# Altium schematic sheet HYDRA_REGULATORS.SchDoc
size B; SheetNumber: 5; SheetTotal: 11
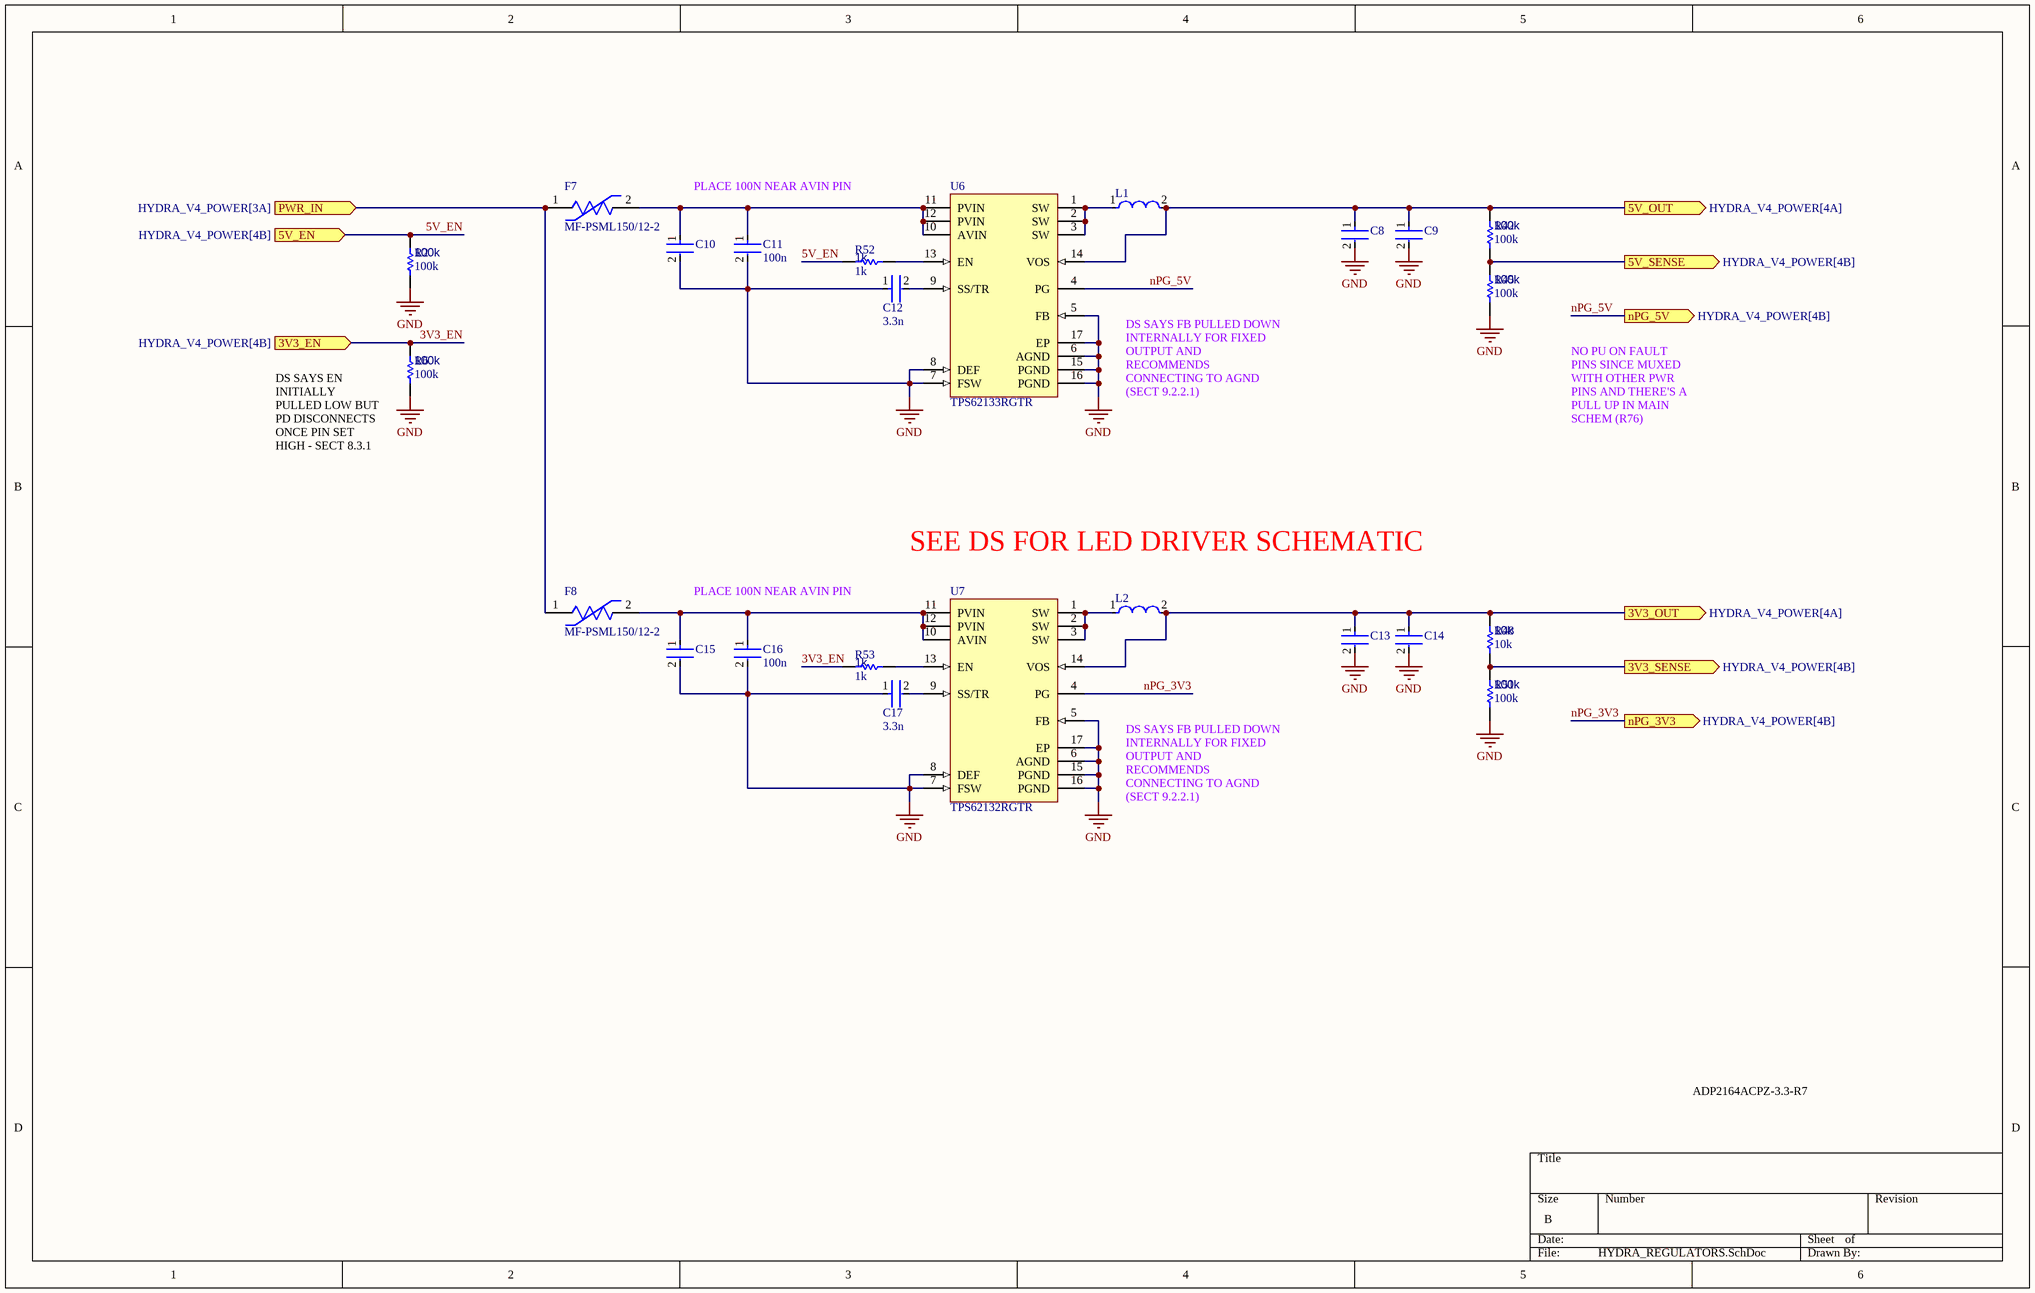
[diagram p0: HYDRA_REGULATORS.SchDoc]

## Parts
C8  GRM21BR61E226ME44L  [FP-GRM21B-0_2-e0_2_0_7-IPC_B]  (value not drawn)
C9  TMK212BBJ106KG-T  [FP-0805-L_2_0_0_2-W_1_25-MFG]  (value not drawn)
C10  TMK212BBJ106KG-T  [FP-0805-L_2_0_0_2-W_1_25-MFG]  (value not drawn)
C11  100n  [FP-0402-L_1_0_0_05-W_0_5-IPC_A]
C12  3.3n  [FP-0402-L_1_0_0_05-W_0_5-IPC_A]
C13  GRM21BR61E226ME44L  [FP-GRM21B-0_2-e0_2_0_7-IPC_B]  (value not drawn)
C14  TMK212BBJ106KG-T  [FP-0805-L_2_0_0_2-W_1_25-MFG]  (value not drawn)
C15  TMK212BBJ106KG-T  [FP-0805-L_2_0_0_2-W_1_25-MFG]  (value not drawn)
C16  100n  [FP-0402-L_1_0_0_05-W_0_5-IPC_A]
C17  3.3n  [FP-0402-L_1_0_0_05-W_0_5-IPC_A]
F7  MF-PSML150/12-2  [FP-MF-PSMF-MFG]
F8  MF-PSML150/12-2  [FP-MF-PSMF-MFG]
L1  IHLP1212BZER2R2M11  [FP-IHLP-1212BZ-11-MFG]  (value not drawn)
L2  IHLP1212BZER2R2M11  [FP-IHLP-1212BZ-11-MFG]  (value not drawn)
R2  100k  [R0603B]
R6  100k  [R0603B]
R42  100k  [R0603B]
R45  100k  [R0603B]
R48  10k  [R0603B]
R51  100k  [R0603B]
R52  1k  [R0603B]
R53  1k  [R0603B]
U6  TPS62133RGTR  [RGT0016C_V]
U7  TPS62132RGTR  [RGT0016C_V]

## Ports
3V3_EN (in, see HYDRA_V4_POWER[4B]), 3V3_OUT (out, see HYDRA_V4_POWER[4A]), 3V3_SENSE (out, see HYDRA_V4_POWER[4B]), 5V_EN (in, see HYDRA_V4_POWER[4B]), 5V_OUT (out, see HYDRA_V4_POWER[4A]), 5V_SENSE (out, see HYDRA_V4_POWER[4B]), nPG_3V3 (out, see HYDRA_V4_POWER[4B]), nPG_5V (out, see HYDRA_V4_POWER[4B]), PWR_IN (in, see HYDRA_V4_POWER[3A])

## Nets
GND: C8.2 C9.2 C10.2 C11.2 C12.1 C13.2 C14.2 C15.2 C16.2 C17.1 R2.2 R6.2 R45.1 R51.1 U6.5(FB) U6.6(AGND) U6.7(FSW) U6.8(DEF) U6.15(PGND) U6.16(PGND) U6.17(EP) U7.5(FB) U7.6(AGND) U7.7(FSW) U7.8(DEF) U7.15(PGND) U7.16(PGND) U7.17(EP)
3V3_EN: R6.1 R53.2 ; port 3V3_EN
3V3_OUT: C13.1 C14.1 L2.2 R48.2 U7.14(VOS) ; port 3V3_OUT
3V3_SENSE: R48.1 R51.2 ; port 3V3_SENSE
5V_EN: R2.1 R52.2 ; port 5V_EN
5V_OUT: C8.1 C9.1 L1.2 R42.2 U6.14(VOS) ; port 5V_OUT
5V_SENSE: R42.1 R45.2 ; port 5V_SENSE
nPG_3V3: U7.4(PG) ; port nPG_3V3
nPG_5V: U6.4(PG) ; port nPG_5V
PWR_IN: F7.1 F8.1 ; port PWR_IN
NetC10_1: C10.1 C11.1 F7.2 U6.10(AVIN) U6.11(PVIN) U6.12(PVIN)
NetC12_2: C12.2 U6.9(SS/TR)
NetC15_1: C15.1 C16.1 F8.2 U7.10(AVIN) U7.11(PVIN) U7.12(PVIN)
NetC17_2: C17.2 U7.9(SS/TR)
NetL1_1: L1.1 U6.1(SW) U6.2(SW) U6.3(SW)
NetL2_1: L2.1 U7.1(SW) U7.2(SW) U7.3(SW)
NetR52_1: R52.1 U6.13(EN)
NetR53_1: R53.1 U7.13(EN)

## Notes on the sheet
- PLACE 100N NEAR AVIN PIN
- DS SAYS FB PULLED DOWN INTERNALLY FOR FIXED OUTPUT AND RECOMMENDS CONNECTING TO AGND (SECT 9.2.2.1)
- NO PU ON FAULT PINS SINCE MUXED WITH OTHER PWR PINS AND THERE'S A PULL UP IN MAIN SCHEM (R76)
- (near R6) DS SAYS EN INITIALLY PULLED LOW BUT PD DISCONNECTS ONCE PIN SET HIGH - SECT 8.3.1
- SEE DS FOR LED DRIVER SCHEMATIC
- ADP2164ACPZ-3.3-R7

## Library data of the parts
C8 C13 = CMP-2007-03222-3: Chip Multilayer Ceramic Capacitors for General Purpose, 0805, 22uF, X5R, 15%, 20%, 25V; Case/Package: 0805; Depth: 1.25mm; Resistor Type: Ceramic; Voltage Rating: 25V; Lead Free: Lead Free; Voltage Rating (DC): 25V; Case Code (Metric): 2012; Thickness: 0.057inch; REACH SVHC: No SVHC; Material: Ceramic; Tolerance: 20%; Length: 2mm; Capacitance: 22uF; Case Code (Imperial): 0805; Max Operating Temperature: 85°C; Termination: SMD/SMT; Weight: 0.000335oz; Dielectric: X5R; Packaging: Tape and Reel; Voltage: 25V; Package Quantity: 3000; Height: 1.25mm; Mount: Surface Mount; Width: 1.25mm; Min Operating Temperature: -55°C; Value: GRM21BR61E226ME44L
C9 C10 C14 C15 = CMP-14477-000079-3: Multilayer Ceramic Capacitor 10uF 25V X5R 10% SMD 0805 T/R; Voltage: 16V; Dielectric: X7R; Number of Pins: 2; Width: 0.049inch; REACH SVHC: No SVHC; Packaging: Tape and Reel; Max Operating Temperature: 85°C; Length: 0.079inch; Termination: SMD/SMT; RoHS Compliant: Yes; Thickness: 0.053inch; Case/Package: 0805; Case Code (Imperial): 0805; Capacitance: 10uF; Lead Free: Lead Free; Voltage Rating: 25V; Resistor Type: Ceramic; Voltage Rating (DC): 25V; Case Code (Metric): 2012; Mount: Surface Mount; Package Quantity: 1; Height: 1.25mm; Series: M; Tolerance: 10%; Min Operating Temperature: -55°C; Value: TMK212BBJ106KG-T
C11 C12 C16 C17 = CMP-001-00058-1: LARGE PADS, 0402 CAP, CHANGE COMMENT TO MATCH REAL P/N; Capacitor Type: Ceramic; Min Operating Temperature: -55°C; Mounting Technology: Surface Mount; Pins: 2; Case/Package: 0402; RoHS Compliant: Yes; Max Operating Temperature: 85°C
  C11 C16: Value: 100n
  C12 C17: Value: 3.3n
F7 F8 = CMP-07400-000013-1: Manufacturer Part Number: MF-PSMF050X-2; Manufacturer: Bourns Inc.; Trip Current: 1A; Trip Time: 0.1s; Value: 0.15-0.9Ω; Hold Current: 0.5A; Current Rating: 40A; Voltage Rating: 6V; Category: Fuse; Temperature: -40°C to +85°C; ComponentLink2Description: Datasheet; Temperature Range High: +85°C; Package: MF-PSMF; Device Class L1: Circuit Protection; Lead Free: Yes; ComponentLink2URL: https://www.bourns.com/docs/product-datasheets/mfpsmf.pdf?sfvrsn=9c05cafe_24; Ambient Temperature Range Low: -40°C; Mouser Description: Resettable Fuses - PPTC .50A 6V 0.15ohm Hold .5 Trip 1; Resistance: 0.15-0.9Ω; Automotive: Yes; Ambient Temperature Range High: +85°C; Device Class L2: PTC Resettable Fuses; Temperature Range Low: -40°C; Device Class L3: unset; Octopart: https://octopart.com/mf-psmf050x-2-bourns-7483438; Digikey Description: PTC RESET FUSE 6V 500MA 0805; Height: 0.85mm; RoHS: TRUE
L1 L2 = CMP-02424-000689-1: FIXED IND 2.2UH 3A 46 MOHM SMD; DC Resistance (DCR): 46mR; Inductance Tolerance: 20%; Saturation Current: 3.3A; Self Resonant Frequency: 55MHz; Core Material: Metal; Shielding: Shielded; Test Frequency: 100kHz; RMS Current (Irms): 3A; Max DC Current: 3A; Contact Plating: Tin; Mount: Surface Mount; Series: IHLP-1212BZ-11; Inductance: 2.2uH; Current Rating: 3A; Height - Seated (Max): 0.079inch; Radiation Hardening: No; Package Quantity: 3000; Max Operating Temperature: 125°C; Military Standard: Not; Depth: 3.2mm; Rated Current-Max: 3A; Height: 2mm; Lead Free: Lead Free; Termination: SMD/SMT; RoHS Compliant: Yes; Tolerance: 20%; Packaging: Tape and Reel; Case/Package: 1212; Number of Pins: 2; Min Operating Temperature: -55°C; Width: 3mm; Length: 3.6mm
R2 R6 R42 R45 R48 R51-R53 = CMP-009-00002-14: Resistor
  R2 R6 R42 R45 R51: Value: 100k
  R48: Value: 10k
  R52 R53: Value: 1k
U6 = CMP-0323-00146-3: Buck Step Down Regulator with 3 to 17 V Input and 5 V Output, -40 to 85 degC, 16-Pin QFN (RGT), Green (RoHS & no Sb/Br); Manufacturer: Texas Instruments; Preset Vout(V): 5; Regulated Outputs(#): 1; Synchronous Rectification: TRUE; Duty Cycle(Max)(%): 100; Vin(Min)(V): 3; Vin(Max)(V): 17; Rating: Catalog; SubFamily: Step-Down Regulator; Switch Current Limit(Typ)(A): 4.2; Iq(Typ)(mA): 0.017; ComponentLink1Description: Datasheet; PackageVersion: revH, Oct-2011; ComponentLink2URL: http://www.ti.com/litv/pdf/mpqf119g; Code_JEDEC: MO-220; ComponentLink2Description: Package Specification; Vout(Max)(V): 5; ComponentLink3URL: Samples URL:http://www.ti.com/product/tps62133#samples; PackageReference: RGT0016C; ComponentLink3Description: URL Link1; Mounting Technology: Surface Mount; DatasheetVersion: SLVSAG7; PartNumber: TPS62133RGTR; Iout(Max)(A): 3; Eco-Plan: Green (RoHS & no Sb/Br); PackageDescription: 16-Pin Plastic Quad Flat No-Lead, 3 x 3 mm Body, 0.5 mm Pitch, 1.7 x 1.7 mm Exposed Pad; Topology: Buck; Vout(Min)(V): 5; ComponentLink1URL: http://www.ti.com/general/docs/lit/getliterature.tsp?genericPartNumber=TPS62133&fileType=pdf
U7 = CMP-0323-00152-3: Buck Step Down Regulator with 3 to 17 V Input and 3.3 V Output, -40 to 85 degC, 16-Pin QFN (RGT), Green (RoHS & no Sb/Br); Manufacturer: Texas Instruments; Switch Current Limit(Typ)(A): 4.2; Vout(Max)(V): 3.3; Iout(Max)(A): 3; Regulated Outputs(#): 1; Rating: Catalog; Vin(Max)(V): 17; Synchronous Rectification: TRUE; SubFamily: Step-Down Regulator; Duty Cycle(Max)(%): 100; Iq(Typ)(mA): 0.017; DatasheetVersion: SLVSAG7; ComponentLink3Description: URL Link1; PartNumber: TPS62132RGTR; ComponentLink1Description: Datasheet; Vin(Min)(V): 3; PackageDescription: 16-Pin Plastic Quad Flat No-Lead, 3 x 3 mm Body, 0.5 mm Pitch, 1.7 x 1.7 mm Exposed Pad; Mounting Technology: Surface Mount; Preset Vout(V): 3.3; Code_JEDEC: MO-220; ComponentLink1URL: http://www.ti.com/general/docs/lit/getliterature.tsp?genericPartNumber=TPS62132&fileType=pdf; Vout(Min)(V): 3.3; Eco-Plan: Green (RoHS & no Sb/Br); ComponentLink2URL: http://www.ti.com/litv/pdf/mpqf119g; ComponentLink2Description: Package Specification; PackageReference: RGT0016C; PackageVersion: revH, Oct-2011; Topology: Buck; ComponentLink3URL: Samples URL:http://www.ti.com/product/tps62132#samples